# EAGLE design WiFi_Module (EAGLE 9.1.3)
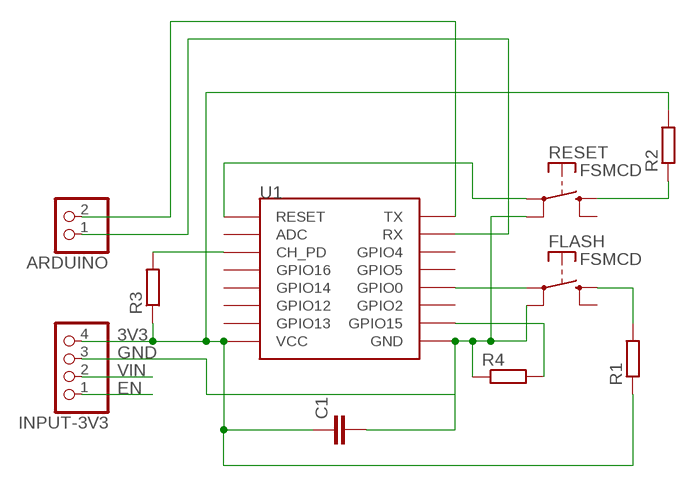
[diagram p0: schematic, sheet 1]

## Parts
ARDUINO  PINHD-1X2  [1X02]
C1  C2.5/2  [C2.5-2]
FLASH  FSMCD  [FSMCD]
INPUT-3V3  PINHD-1X4  [1X04]
R1  R-EU_0204/5  [0204/5]
R2  R-EU_0204/5  [0204/5]
R3  R-EU_0204/5  [0204/5]
R4  R-EU_0204/5  [0204/5]
RESET  FSMCD  [FSMCD]
U1  ESP12SMD  [ESP12-SMD]

## Nets
3V3: C1.1 INPUT-3V3.4 R1.1 R2.2 R3.1 U1.VCC
EN: INPUT-3V3.1
GND: C1.2 FLASH.P$2(P) INPUT-3V3.3 R4.1 RESET.P$2(P) U1.GND
N$1: R2.1 RESET.P$3(S)
N$2: RESET.P$1(P) U1.RESET
N$3: FLASH.P$1(P) U1.GPIO0
N$4: FLASH.P$3(S) R1.2
N$5: R3.2 U1.CH_PD
N$6: R4.2 U1.GPIO15
N$7: ARDUINO.2 U1.TXD0(TX)
N$8: ARDUINO.1 U1.RXD0(RX)
VIN: INPUT-3V3.2
Unconnected: FLASH.P$4(S) RESET.P$4(S) U1.ADC U1.GPIO2 U1.GPIO4 U1.GPIO5 U1.GPIO12 U1.GPIO13 U1.GPIO14 U1.GPIO16

## Library data of the parts
ARDUINO = pinhead:PINHD-1X2: PIN HEADER
C1 = capacitor-wima:C: CAPACITOR naming: grid - package width
FLASH RESET = switch-misc:FSMCD: TYCO SWITCH
INPUT-3V3 = pinhead:PINHD-1X4: PIN HEADER
R1-R4 = rcl:R-EU_: RESISTOR, European symbol; SPICEPREFIX: R
U1 = esp8266modules:ESP12: ESP8266 Wifi module 12

## Board
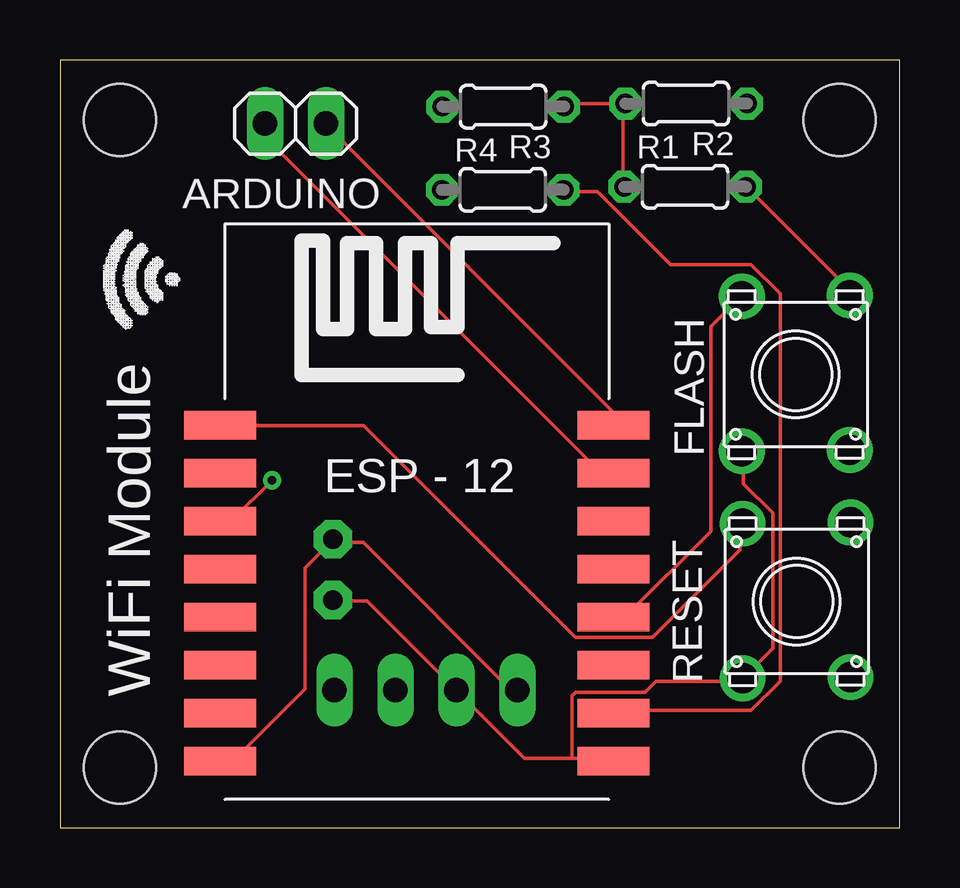
[diagram p1: board, top side]
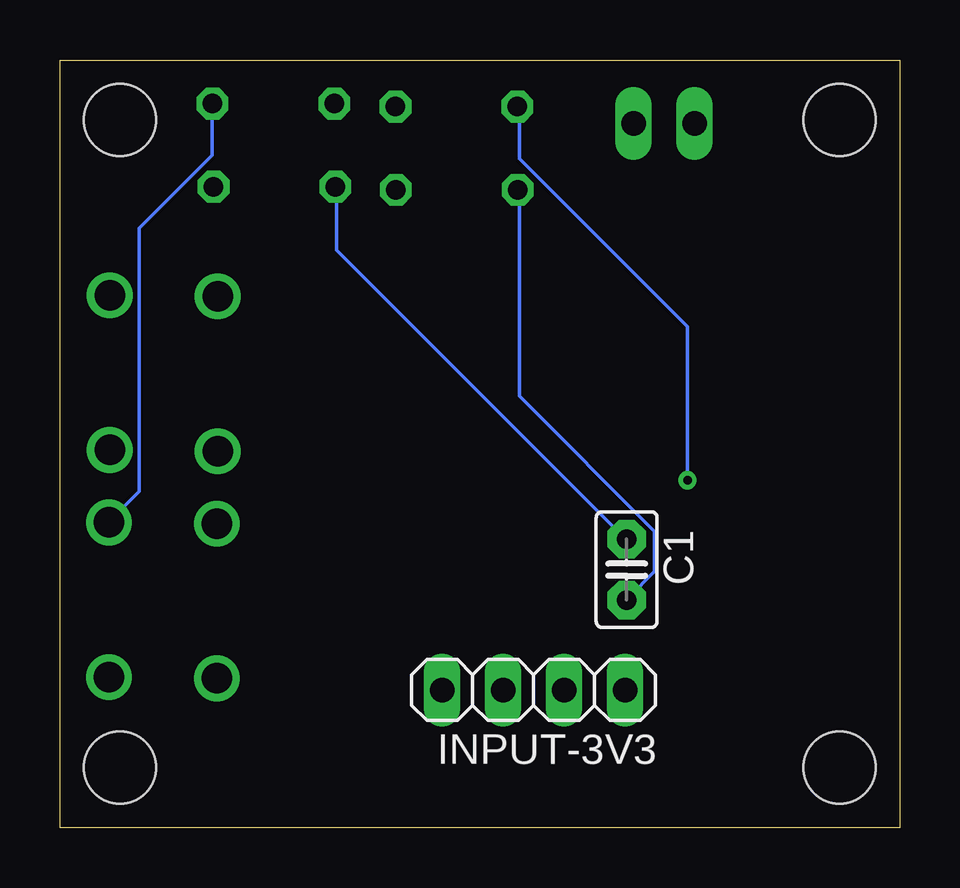
[diagram p2: board, bottom side, seen from below]

Size 35 x 32 mm. Coordinates in mm from the lower left corner, seen from the top.
Outline: 0,0 35,0 35,32 0,32 0,0
Copper layers (1*16): Top 0.035mm / dielectric 1.5mm / Bottom 0.035mm
Design rules "default": minimum track width 6mil, minimum drill 0.35mm, track to track 6mil, track to pad 6mil, pad to pad 6mil, via to via 6mil, smd to smd 6mil, copper to edge 40mil, drill to drill 6mil, minimum pad ring 10mil, minimum via ring 8mil, stop-mask expansion 4mil, vias tented up to drill 0mil, thermal gap 10mil
Holes 3 mm at 2.5,2.5 32.5,2.5 2.5,29.5 32.5,29.5

### Footprints (pad centres in the part's own frame; a part is rotated, then mirrored left to right if it is on the bottom)
1X02 = drill 1.016 long: 1 -1.27,0; 2 1.27,0
C2.5-2 = drill 0.813 pad 1.6 octagon: 1 -1.27,0; 2 1.27,0
FSMCD = drill 1.27: P$1 -2.25,3.25; P$2 -2.25,-3.2; P$3 2.25,3.3; P$4 2.25,-3.15
1X04 = drill 1.016 long: 1 -3.81,0; 2 -1.27,0; 3 1.27,0; 4 3.81,0
0204/5 = drill 0.813 octagon: 1 -2.54,0; 2 2.54,0
ESP12-SMD = smd 3 x 1.2: ADC -8.3,3.8; CH_PD -8.3,1.8; GND 8.1,-8.2; GPIO0 8.1,-2.2; GPIO2 8.1,-4.2; GPIO4 8.1,1.8; GPIO5 8.1,-0.2; GPIO12 -8.3,-4.2; GPIO13 -8.3,-6.2; GPIO14 -8.3,-2.2; GPIO15 8.1,-6.2; GPIO16 -8.3,-0.2; RESET -8.3,5.8; RXD0 8.1,3.8; TXD0 8.1,5.8; VCC -8.3,-8.2

### Placement (x,y rotation side)
ARDUINO  9.82,29.35 0 top
C1  11.38,10.75 270 bottom
FLASH  30.67,18.89 0 top
INPUT-3V3  15.25,5.74 180 bottom
R1  26.06,26.71 0 top
R2  26.1,30.18 180 top
R3  18.47,30.05 180 top
R4  18.46,26.59 0 top
RESET  30.71,9.42 0 top
U1  14.98,10.97 0 top

### Tracks (layer width: path | path; a pad name or v marks a point on that pad's centre or on a via)
3V3
  Top 0.152: 23.47,30.18 21.03,30.18 R3.1 | 23.47,30.18 23.47,26.82 R1.1 | 23.47,30.18 R2.2 | U1.VCC 6.71,2.9 7.32,2.9 10.21,5.79 10.21,10.82 11.28,11.89 C1.1 11.43,11.89 12.65,11.89 18.75,5.79 19.05,5.79 INPUT-3V3.4
  Bottom 0.152: R1.1 23.47,26.67 23.47,24.08 11.43,12.04 C1.1
GND
  Top 0.152: 21.34,2.9 19.36,2.9 16.61,5.64 INPUT-3V3.3 16.46,5.79 12.8,9.45 11.43,9.45 C1.2 | 21.34,2.9 23.01,2.9 U1.GND | 21.34,2.9 21.34,5.49 21.49,5.64 24.38,5.64 24.84,6.1 28.35,6.1 RESET.P$2 28.5,6.25 29.72,7.47 29.72,13.11 28.5,14.33 28.5,15.54 FLASH.P$2
  Bottom 0.152: R4.1 15.85,26.52 15.85,17.98 10.21,12.34 10.21,10.67 11.28,9.6 C1.2
N$1
  Bottom 0.152: R2.1 28.65,28.04 31.7,24.99 31.7,14.02 32.92,12.8 RESET.P$3
N$2
  Top 0.152: U1.RESET 6.71,16.76 12.65,16.76 21.49,7.92 24.69,7.92 28.35,11.58 28.35,12.65 RESET.P$1
N$3
  Top 0.152: U1.GPIO0 23.16,8.84 23.62,8.84 27.13,12.34 27.13,20.88 28.35,22.1 FLASH.P$1
N$4
  Top 0.152: R1.2 28.65,26.67 33.07,22.25 FLASH.P$3
N$5  (via drill 0.35)
  Top 0.152: v8.84,14.48 7.16,12.8 6.71,12.8 U1.CH_PD
  Bottom 0.152: v8.84,14.48 8.84,20.88 15.85,27.89 15.85,30.02 R3.2
N$6
  Top 0.152: R4.2 21.03,26.52 22.4,26.52 25.45,23.47 28.8,23.47 30.02,22.25 30.02,6.1 28.8,4.88 23.16,4.88 U1.GPIO15
N$7
  Top 0.152: U1.TXD0 23.01,16.92 23.01,17.37 11.12,29.26 ARDUINO.2
N$8
  Top 0.152: U1.RXD0 23.01,14.78 22.55,14.78 8.69,28.65 8.69,29.26 ARDUINO.1

### Text on the board
tNames: WiFi Module